# EAGLE design seven_buttons (EAGLE 9.6.2)
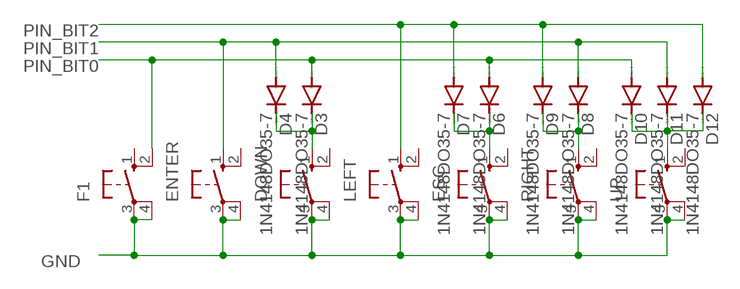
[diagram p0: schematic, sheet 1]

## Parts
D3  1N4148DO35-7  [DO35-7]
D4  1N4148DO35-7  [DO35-7]
D6  1N4148DO35-7  [DO35-7]
D7  1N4148DO35-7  [DO35-7]
D8  1N4148DO35-7  [DO35-7]
D9  1N4148DO35-7  [DO35-7]
D10  1N4148DO35-7  [DO35-7]
D11  1N4148DO35-7  [DO35-7]
D12  1N4148DO35-7  [DO35-7]
DOWN  10-XX  [B3F-10XX]
ENTER  10-XX  [B3F-10XX]
ESC  10-XX  [B3F-10XX]
F1  10-XX  [B3F-10XX]
LEFT  10-XX  [B3F-10XX]
RIGHT  10-XX  [B3F-10XX]
UP  10-XX  [B3F-10XX]

## Nets
GND: DOWN.3(P) DOWN.4(P1) ENTER.3(P) ENTER.4(P1) ESC.3(P) ESC.4(P1) F1.3(P) F1.4(P1) LEFT.3(P) LEFT.4(P1) RIGHT.3(P) RIGHT.4(P1) UP.3(P) UP.4(P1)
N$5: D3.C D4.C DOWN.1(S)
N$8: D6.C D7.C ESC.1(S)
N$10: D8.C D9.C RIGHT.1(S)
N$12: D10.C D11.C D12.C UP.1(S)
PIN_BIT0: D3.A D6.A D10.A F1.2(S1)
PIN_BIT1: D4.A D8.A D11.A ENTER.1(S)
PIN_BIT2: D7.A D9.A D12.A LEFT.1(S)
Unconnected: DOWN.2(S1) ENTER.2(S1) ESC.2(S1) F1.1(S) LEFT.2(S1) RIGHT.2(S1) UP.2(S1)

## Library data of the parts
D3 D4 D6-D12 = diode:1N4148: DIODE high speed (Philips)
DOWN ENTER ESC F1 LEFT RIGHT UP = switch-omron:10-XX: OMRON SWITCH; MPN: B3F-1000; OC_FARNELL: 176432; OC_NEWARK: 36M3542

## Board
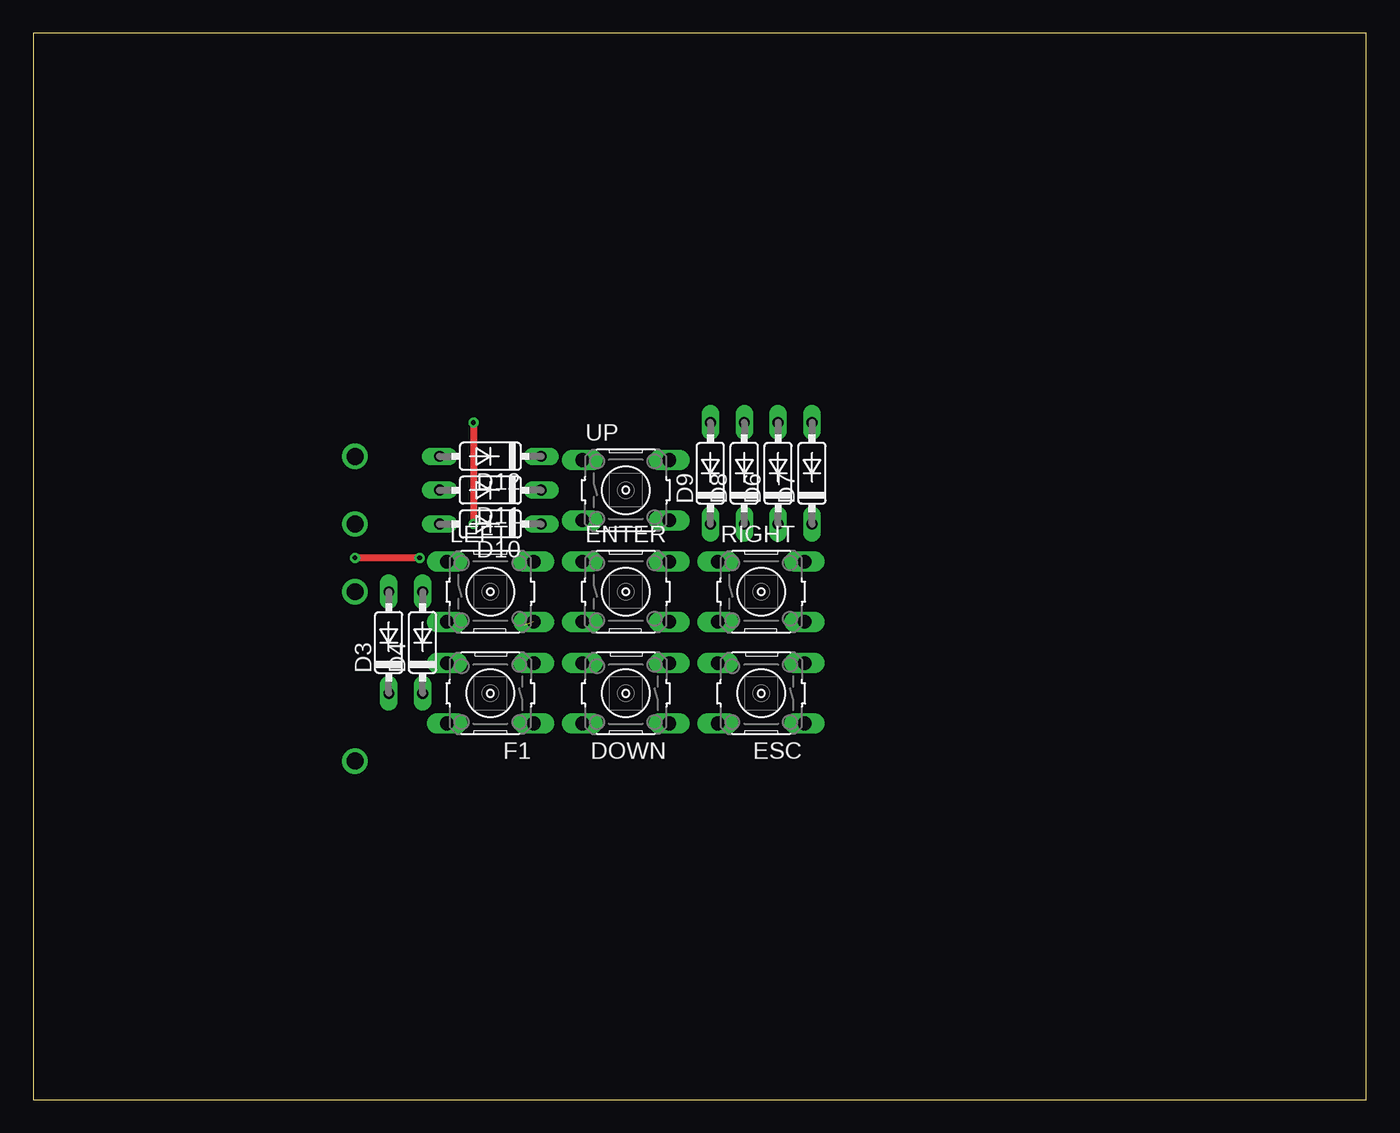
[diagram p1: board, top side]
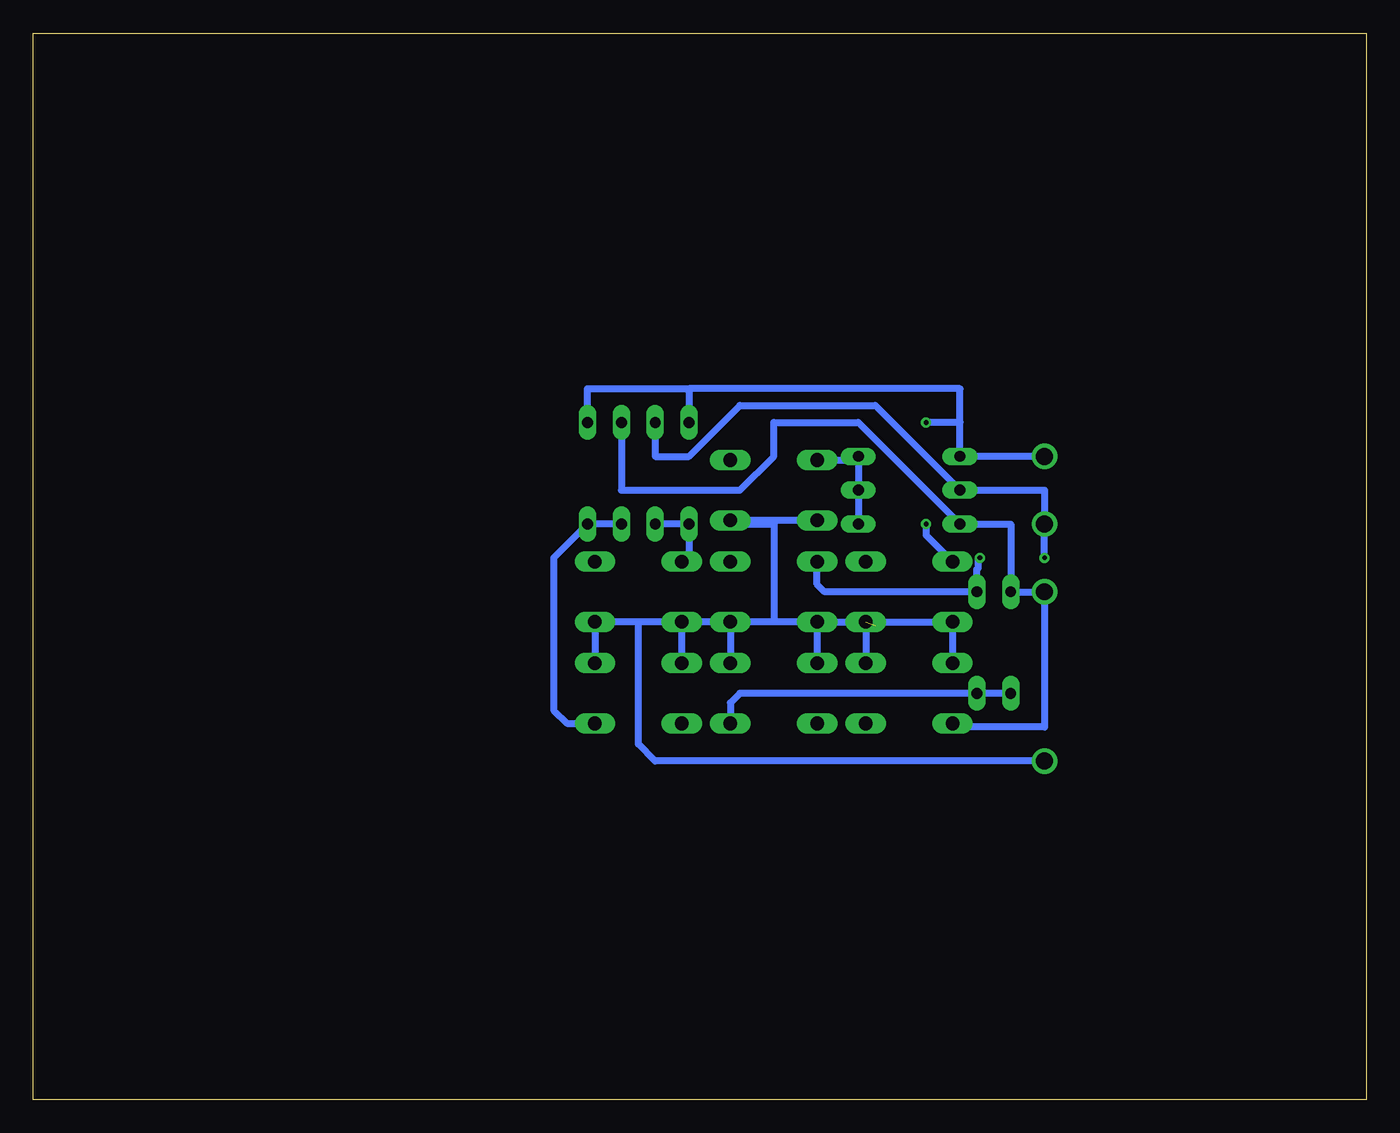
[diagram p2: board, bottom side, seen from below]

Size 100 x 80 mm. Coordinates in mm from the lower left corner, seen from the top.
Outline: 0,0 100,0 100,80 0,80 0,0
Copper layers (1*16): Top 0.035mm / dielectric 1.5mm / Bottom 0.035mm
Design rules "default": minimum track width 6mil, minimum drill 0.35mm, track to track 6mil, track to pad 6mil, pad to pad 6mil, via to via 6mil, smd to smd 6mil, copper to edge 40mil, drill to drill 6mil, minimum pad ring 10mil, minimum via ring 8mil, stop-mask expansion 4mil, vias tented up to drill 0mil, thermal gap 10mil

### Footprints (pad centres in the part's own frame; a part is rotated, then mirrored left to right if it is on the bottom)
DO35-7 = drill 0.813 long: A 3.81,0; C -3.81,0
B3F-10XX = drill 1.016 long: 1 -3.251,2.261; 2 3.251,2.261; 3 -3.251,-2.261; 4 3.251,-2.261

### Placement (x,y rotation side)
D3  26.67,34.29 90 top
D4  29.21,34.29 90 top
D6  55.88,46.99 90 top
D7  58.42,46.99 90 top
D8  53.34,46.99 90 top
D9  50.8,46.99 90 top
D10  34.29,43.18 180 top
D11  34.29,45.72 180 top
D12  34.29,48.26 180 top
DOWN  44.45,30.48 180 top
ENTER  44.45,38.1 0 top
ESC  54.61,30.48 180 top
F1  34.29,30.48 180 top
LEFT  34.29,38.1 0 top
RIGHT  54.61,38.1 0 top
UP  44.45,45.72 0 top

### Tracks (layer width: path | path; a pad name or v marks a point on that pad's centre or on a via)
GND  (via drill 1.27)  (1 unrouted)
  Bottom 0.508: 36.55,35.84 36.83,35.56 | ENTER.3 44.45,35.84 44.45,43.18 47.42,43.18 UP.4 UP.3 | ENTER.3 DOWN.4 | ENTER.3 LEFT.4 | LEFT.4 LEFT.3 F1.4 | RIGHT.3 54.61,35.84 | 54.61,35.84 RIGHT.4 ESC.3 | RIGHT.3 ESC.4 | LEFT.4 F1.3 | ENTER.3 ENTER.4 | ENTER.4 DOWN.3 | ENTER.4 RIGHT.3 | v24.13,25.4 53.34,25.4 54.61,26.67 54.61,35.84
N$5
  Bottom 0.508: DOWN.1 47.7,29.77 46.99,30.48 D4.C D3.C
N$8
  Bottom 0.508: D6.C D7.C 60.96,40.64 60.96,29.21 59.97,28.22 ESC.1
N$10
  Bottom 0.508: RIGHT.1 50.8,40.92 D9.C D8.C
N$12
  Bottom 0.508: UP.1 38.38,47.98 D12.C D11.C D10.C
PIN_BIT0  (via drill 1.27)
  Bottom 0.508: D6.A 55.88,45.72 46.99,45.72 44.45,48.26 44.45,50.8 38.1,50.8 D10.A 26.67,43.18 D3.A v24.13,38.1 24.13,27.94 30.76,27.94 F1.2
PIN_BIT1  (via drill 0.35, 1.27)
  Top 0.508: v28.98,40.64 v24.13,40.64
  Bottom 0.508: D8.A 53.34,48.26 50.8,48.26 46.99,52.07 36.83,52.07 D11.A 24.13,45.72 v24.13,43.18 v24.13,40.64 | ENTER.1 41.2,38.66 40.64,38.1 D4.A 29.21,39.77 29.11,39.88 29.11,40.64 v28.98,40.64
PIN_BIT2  (via drill 0.35, 1.27)
  Top 0.508: v33.02,50.8 v33.02,43.18
  Bottom 0.508: D7.A 58.42,53.34 50.8,53.34 | 50.8,53.34 D9.A | 50.8,53.34 30.48,53.34 30.48,50.8 | 30.48,50.8 D12.A v24.13,48.26 | 30.48,50.8 v33.02,50.8 | v33.02,43.18 33.02,42.34 LEFT.1